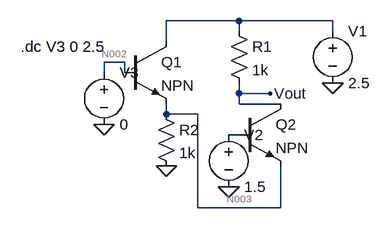
[diagram p0: schematic tut2 Q5.asc]
tut2 Q5.asc, the LTspice schematic file:
Version 4
SHEET 1 880 680
WIRE 176 48 64 48
WIRE 320 48 176 48
WIRE 176 64 176 48
WIRE 320 64 320 48
WIRE 64 80 64 48
WIRE 0 112 -32 112
WIRE -32 128 -32 112
WIRE 0 128 0 112
WIRE 176 160 176 144
WIRE 224 160 176 160
WIRE 176 176 176 160
WIRE 240 176 176 176
WIRE 64 192 64 176
WIRE 112 192 64 192
WIRE 176 224 160 224
WIRE 112 336 112 192
WIRE 240 336 240 272
WIRE 240 336 112 336
FLAG -32 208 0
FLAG 64 272 0
FLAG 160 304 0
FLAG 320 144 0
FLAG 224 160 Vout
SYMBOL voltage 320 48 R0
WINDOW 123 0 0 Left 2
WINDOW 39 0 0 Left 2
SYMATTR InstName V1
SYMATTR Value 2.5
SYMBOL res 160 48 R0
SYMATTR InstName R1
SYMATTR Value 1k
SYMBOL res 48 176 R0
SYMATTR InstName R2
SYMATTR Value 1k
SYMBOL npn 0 80 R0
SYMATTR InstName Q1
SYMBOL npn 176 176 R0
SYMATTR InstName Q2
SYMBOL voltage 160 208 R0
WINDOW 123 0 0 Left 2
WINDOW 39 0 0 Left 2
SYMATTR InstName V2
SYMATTR Value 1.5
SYMBOL voltage -32 112 R0
WINDOW 123 0 0 Left 2
WINDOW 39 0 0 Left 2
SYMATTR InstName V3
SYMATTR Value 0
TEXT -160 88 Left 2 !.dc V3 0 2.5

The netlist it stands for:
* tut2 Q5.asc
V1 N001 0 2.5
R1 N001 Vout 1k
R2 N003 0 1k
Q1 N001 N002 N003 0 NPN
Q2 Vout N004 N003 0 NPN
V2 N004 0 1.5
V3 N002 0 0
.model NPN NPN
.model PNP PNP
.lib standard.bjt
.dc V3 0 2.5
.backanno
.end

* Results of the author's LTspice run, read from the files saved beside the schematic
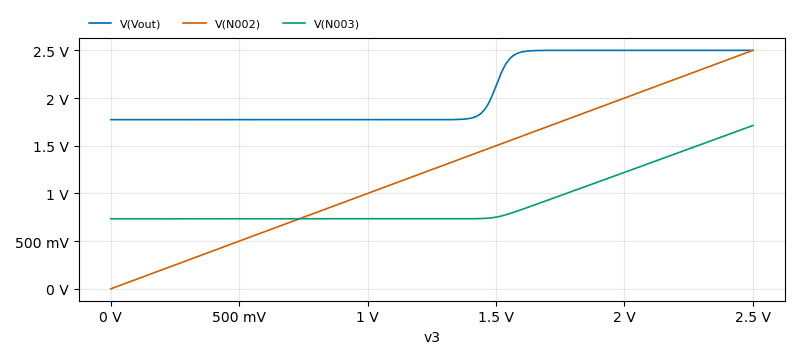
[diagram p1: DC transfer characteristic of tut2 Q5.asc, plotted from the saved traces]
* DC transfer characteristic, 1 run:
*   V(Vout): 1.773 V at v3=0 V, 2.5 V at v3=2.5 V, min 1.773 V, max 2.5 V
*   V(N002): 0 V at v3=0 V, 2.5 V at v3=2.5 V, min 0 V, max 2.5 V
*   V(N003): 734 mV at v3=0 V, 1.712 V at v3=2.5 V, min 734 mV, max 1.712 V